# EAGLE design VM-MCU_v4.6 (EAGLE 9.6.2)

## Sheet 1 of 3: MAINBOARD UNIT
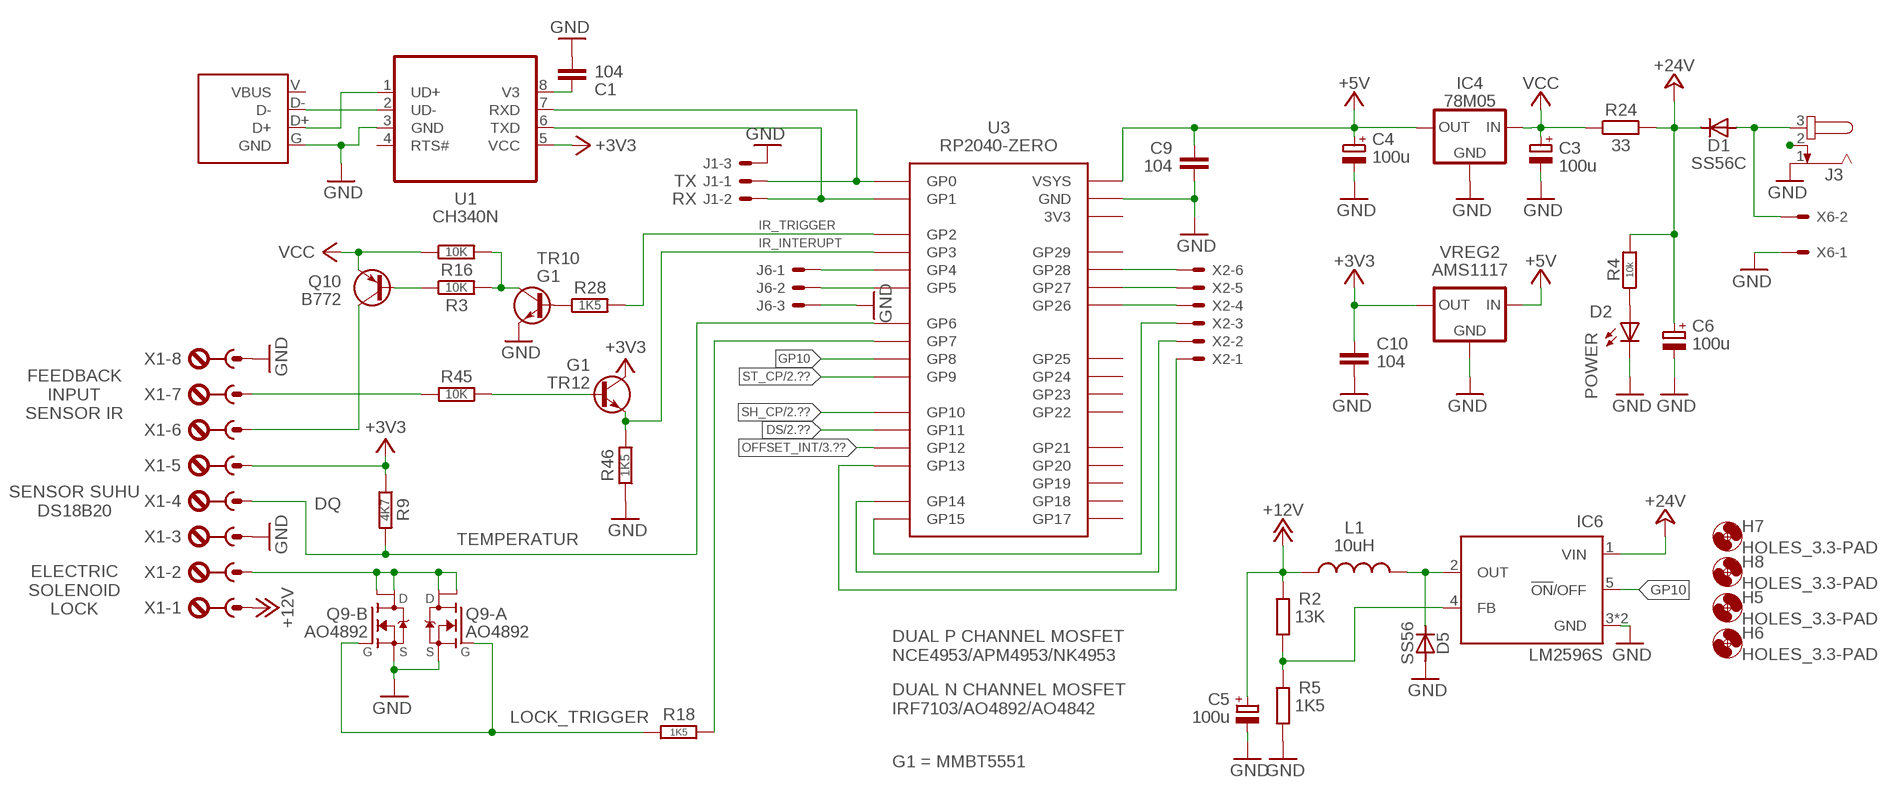
[diagram p0: schematic, sheet 1]

### Parts
C1  104  CAP_SMD-C1206  [C1206]
C3  100u  ELCO_UD-6,3X7,7  [UD-6,3X7,7_NICHICON]
C4  100u  ELCO_UD-6,3X7,7  [UD-6,3X7,7_NICHICON]
C5  100u  ELCO_UD-6,3X7,7  [UD-6,3X7,7_NICHICON]
C6  100u  ELCO_UD-6,3X7,7  [UD-6,3X7,7_NICHICON]
C9  104  CAP_SMD-C1206  [C1206]
C10  104  CAP_SMD-C1206  [C1206]
D1  SS56C  DIODE_DO214AB-SMC  [DO214AB]
D2  POWER  LED2835  [LED2835]
D5  SS56  DIODE_DO214AC  [DO214AC]
H5  HOLES_3.3-PAD  [3,3-PAD]
H6  HOLES_3.3-PAD  [3,3-PAD]
H7  HOLES_3.3-PAD  [3,3-PAD]
H8  HOLES_3.3-PAD  [3,3-PAD]
IC4  78M05  78XXX_TO252  [TO252]
IC6  LM2596S  [TO263-5]
J1  SOKET-3P_JST-XH-2.54  [3P-JST-XH]
J3  JACK-DC_5.5X2.1MM  [DC-5.5X2.1]
J6  SOKET-3P_JST-XH-2.54  [3P-JST-XH]
L1  10uH  INDUKTORSMD  [CDRH127/LD]
Q9  AO4892  DUALFET-N_AO4892N+N  [SO-8]
Q10  B772  BJT-PNP_SOT89  [SOT89-BCE]
R2  13K  RESISTOR_1206  [R1206]
R3  10K  RESISTOR_1206  [R1206]
R4  10k  RESISTOR_1206  [R1206]
R5  1K5  RESISTOR_1206  [R1206]
R9  4K7  RESISTOR_1206  [R1206]
R16  10K  RESISTOR_1206  [R1206]
R18  1K5  RESISTOR_1206  [R1206]
R24  33  RESISTOR_0615/15  [2W-15]
R28  1K5  RESISTOR_1206  [R1206]
R45  10K  RESISTOR_1206  [R1206]
R46  1K5  RESISTOR_1206  [R1206]
TR10  G1  BJT-NPN_SOT23-BEC  [SOT23-BEC]
TR12  G1  BJT-NPN_SOT23-BEC  [SOT23-BEC]
U1  CH340N  [SO-8]
U3  RP2040-ZERO  RASPBERRY-PICO-ZERO_  [PICO-ZERO]
U$3  USB-C_BREAKOUT_  [USB-C_4P]
VREG2  AMS1117  78XXX_SOT223  [SOT223]
X1  TBLOCK-8P_KF2EDG-3.81  [KF2EDG-3.81_8P]
X2  SOKET-6P_JST-XH-2.54  [6P-JST-XH]
X6  SOKET-2P_MOLEX-3.96  [2P-MOLEX]

### Nets
+3V3: C10.1 R9.1 TR12.C U1.5(VCC) VREG2.4(OUT) X1.5 ; also sheet 3
+5V: C4.+ C9.1 IC4.2(OUT) U3.5V(VSYS) VREG2.3(IN) ; also sheet 2
+12V: C5.+ L1.1 R2.1 X1.1
+24V: C6.+ D1.C IC6.1(VIN) R4.2 R24.2 ; also sheet 2
DS: U3.P11(GP11) ; also sheet 2
GND: C1.2 C3.- C4.- C5.- C6.- C9.2 C10.2 D2.C D5.A IC4.3(GND) IC6.3(GND) IC6.6(GND) J1.3 J3.1 J6.3 Q9.1(-A:S) Q9.3(-B:S) R5.2 R46.1 TR10.E U1.3(GND) U3.G(GND) U$3.G(GND) VREG2.1(GND) X1.3 X1.8 X6.1 ; also sheet 2,3
GP10: IC6.5(!ON!/OFF) U3.P8(GP8)
N$1: J1.1 U1.7(RXD) U3.P0(GP0)
N$2: J1.2 U1.6(TXD) U3.P1(GP1)
N$3: D1.A J3.3 X6.2
N$4: D2.A R4.1
N$5: J6.1 U3.P4(GP4)
N$6: R3.2 R16.2 TR10.C
N$7: Q10.B R3.1
N$8: J6.2 U3.P5(GP5)
N$9: U3.P28(GP28) X2.6
N$10: U3.P27(GP27) X2.5
N$11: U3.P26(GP26) X2.4
N$13: U3.P15(GP15) X2.3
N$23: Q10.E X1.6
N$33: Q9.2(-A:G) Q9.4(-B:G) R18.2
N$34: C1.1 U1.8(V3)
N$36: U1.2(UD-) U$3.D-
N$43: J3.2
N$45: U1.1(UD+) U$3.D+
N$46: U3.P14(GP14) X2.2
N$47: U3.P13(GP13) X2.1
N$60: Q9.5(-B:D1) Q9.6(-B:D2) Q9.7(-A:D2) Q9.8(-A:D1) X1.2
N$68: D5.C IC6.2(OUT) L1.2
N$71: IC6.4(FB) R2.2 R5.1
N$73: R28.1 TR10.B
N$74: R45.1 TR12.B
N$86: R45.2 X1.7
OFFSET_INT: U3.P12(GP12) ; also sheet 3
P2: R28.2 U3.P2(GP2)
P3: R46.2 TR12.E U3.P3(GP3)
P6: R9.2 U3.P6(GP6) X1.4
P7: R18.1 U3.P7(GP7)
SH_CP: U3.P10(GP10) ; also sheet 2
ST_CP: U3.P9(GP9) ; also sheet 2
VCC: C3.+ IC4.1(IN) Q10.C R16.1 R24.1
Unconnected: U1.4(RTS#) U3.P17(GP17) U3.P18(GP18) U3.P19(GP19) U3.P20(GP20) U3.P21(GP21) U3.P22(GP22) U3.P23(GP23) U3.P24(GP24) U3.P25(GP25) U3.P29(GP29) U$3.V(VBUS)

### Notes on the sheet
- TX
- RX
- IR_TRIGGER
- IR_INTERUPT
- FEEDBACK
  INPUT
  SENSOR IR
- SENSOR SUHU
  DS18B20
- DQ
- TEMPERATUR
- ELECTRIC
  SOLENOID
  LOCK
- DUAL P CHANNEL MOSFET
  NCE4953/APM4953/NK4953
- DUAL N CHANNEL MOSFET
  IRF7103/AO4892/AO4842
- LOCK_TRIGGER
- G1 = MMBT5551

## Sheet 2 of 3: SHIFT REGISTER & MOSFET DRIVER
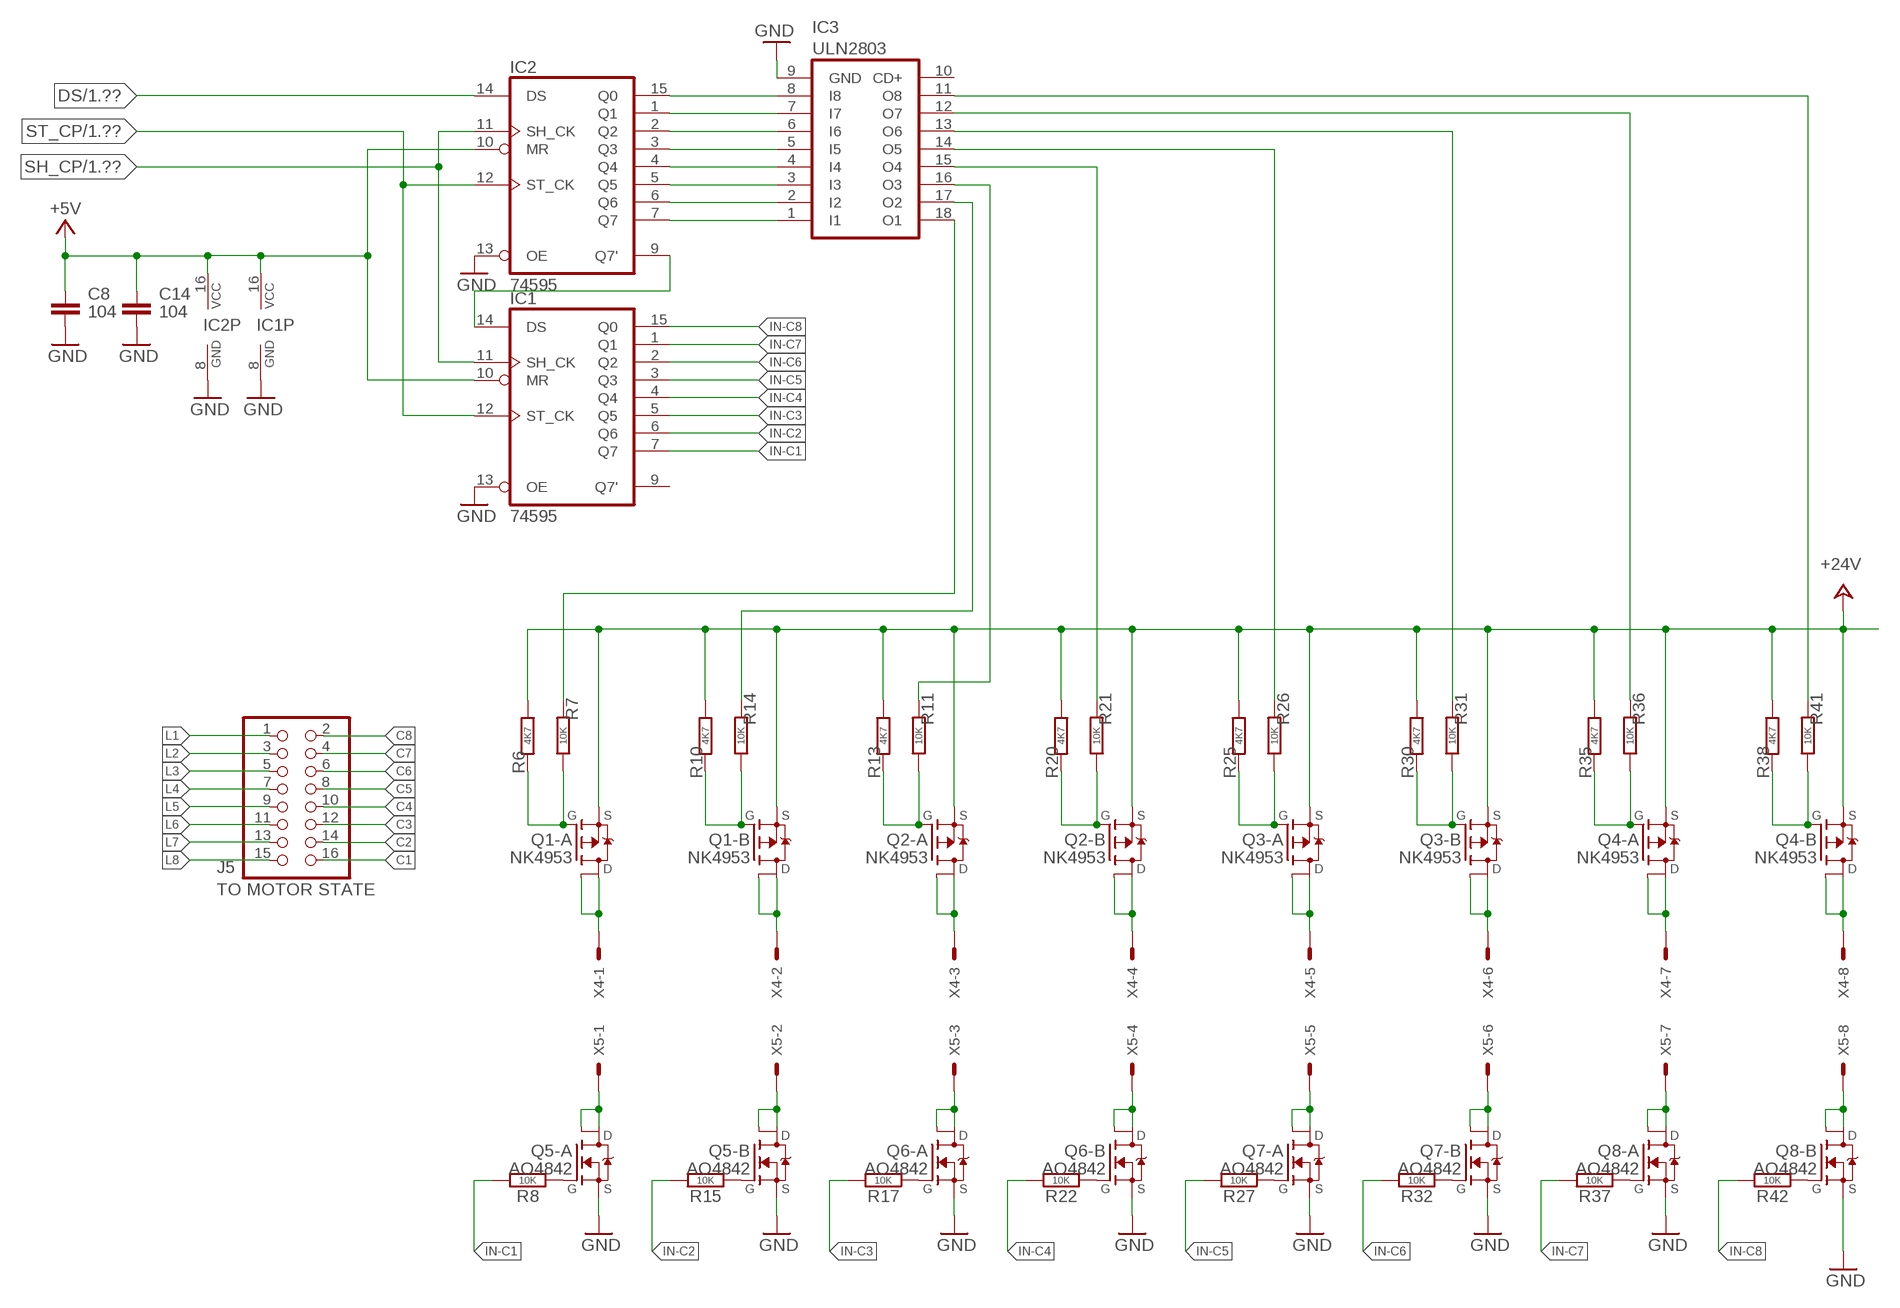
[diagram p1: schematic, sheet 2]

### Parts
C8  104  CAP_SMD-C1206  [C1206]
C14  104  CAP_SMD-C1206  [C1206]
IC1  74595  [SO16]
IC2  74595  [SO16]
IC3  ULN2803  ULN2805ASO18  [SO18W]
J5  TO MOTOR STATE  PINHEAD_2X8SMT  [PINHEAD-SMT_2X08]
Q1  NK4953  DUALFET-P_NCE4953P+P  [SO-8]
Q2  NK4953  DUALFET-P_NCE4953P+P  [SO-8]
Q3  NK4953  DUALFET-P_NCE4953P+P  [SO-8]
Q4  NK4953  DUALFET-P_NCE4953P+P  [SO-8]
Q5  AO4842  DUALFET-N_AO4892N+N  [SO-8]
Q6  AO4842  DUALFET-N_AO4892N+N  [SO-8]
Q7  AO4842  DUALFET-N_AO4892N+N  [SO-8]
Q8  AO4842  DUALFET-N_AO4892N+N  [SO-8]
R6  4K7  RESISTOR_1206  [R1206]
R7  10K  RESISTOR_1206  [R1206]
R8  10K  RESISTOR_1206  [R1206]
R10  4K7  RESISTOR_1206  [R1206]
R11  10K  RESISTOR_1206  [R1206]
R13  4K7  RESISTOR_1206  [R1206]
R14  10K  RESISTOR_1206  [R1206]
R15  10K  RESISTOR_1206  [R1206]
R17  10K  RESISTOR_1206  [R1206]
R20  4K7  RESISTOR_1206  [R1206]
R21  10K  RESISTOR_1206  [R1206]
R22  10K  RESISTOR_1206  [R1206]
R25  4K7  RESISTOR_1206  [R1206]
R26  10K  RESISTOR_1206  [R1206]
R27  10K  RESISTOR_1206  [R1206]
R30  4K7  RESISTOR_1206  [R1206]
R31  10K  RESISTOR_1206  [R1206]
R32  10K  RESISTOR_1206  [R1206]
R35  4K7  RESISTOR_1206  [R1206]
R36  10K  RESISTOR_1206  [R1206]
R37  10K  RESISTOR_1206  [R1206]
R38  4K7  RESISTOR_1206  [R1206]
R41  10K  RESISTOR_1206  [R1206]
R42  10K  RESISTOR_1206  [R1206]
X4  SOKET-8P_MOLEX-3.96  [8P-MOLEX]
X5  SOKET-8P_MOLEX-3.96  [8P-MOLEX]

### Nets
+5V: C8.1 C14.1 IC1.10(MR) IC1.16(VCC) IC2.10(MR) IC2.16(VCC) ; also sheet 1
+24V: Q1.1(-A:S) Q1.3(-B:S) Q2.1(-A:S) Q2.3(-B:S) Q3.1(-A:S) Q3.3(-B:S) Q4.1(-A:S) Q4.3(-B:S) R6.1 R10.1 R13.1 R20.1 R25.1 R30.1 R35.1 R38.1 ; also sheet 1
C1: J5.16 Q5.7(-A:D2) Q5.8(-A:D1) X5.1
C2: J5.14 Q5.5(-B:D1) Q5.6(-B:D2) X5.2
C3: J5.12 Q6.7(-A:D2) Q6.8(-A:D1) X5.3
C4: J5.10 Q6.5(-B:D1) Q6.6(-B:D2) X5.4
C5: J5.8 Q7.7(-A:D2) Q7.8(-A:D1) X5.5
C6: J5.6 Q7.5(-B:D1) Q7.6(-B:D2) X5.6
C7: J5.4 Q8.7(-A:D2) Q8.8(-A:D1) X5.7
C8: J5.2 Q8.5(-B:D1) Q8.6(-B:D2) X5.8
DS: IC2.14(DS) ; also sheet 1
GND: C8.2 C14.2 IC1.8(GND) IC1.13(OE) IC2.8(GND) IC2.13(OE) IC3.9(GND) Q5.1(-A:S) Q5.3(-B:S) Q6.1(-A:S) Q6.3(-B:S) Q7.1(-A:S) Q7.3(-B:S) Q8.1(-A:S) Q8.3(-B:S) ; also sheet 1,3
IN-C1: IC1.7(Q7) R8.2
IN-C2: IC1.6(Q6) R15.2
IN-C3: IC1.5(Q5) R17.2
IN-C4: IC1.4(Q4) R22.2
IN-C5: IC1.3(Q3) R27.2
IN-C6: IC1.2(Q2) R32.2
IN-C7: IC1.1(Q1) R37.2
IN-C8: IC1.15(Q0) R42.2
L1: J5.1 Q1.7(-A:D2) Q1.8(-A:D1) X4.1
L2: J5.3 Q1.5(-B:D1) Q1.6(-B:D2) X4.2
L3: J5.5 Q2.7(-A:D2) Q2.8(-A:D1) X4.3
L4: J5.7 Q2.5(-B:D1) Q2.6(-B:D2) X4.4
L5: J5.9 Q3.7(-A:D2) Q3.8(-A:D1) X4.5
L6: J5.11 Q3.5(-B:D1) Q3.6(-B:D2) X4.6
L7: J5.13 Q4.7(-A:D2) Q4.8(-A:D1) X4.7
L8: J5.15 Q4.5(-B:D1) Q4.6(-B:D2) X4.8
N$12: IC2.15(Q0) IC3.8(I8)
N$15: IC2.1(Q1) IC3.7(I7)
N$16: Q1.2(-A:G) R6.2 R7.1
N$18: IC3.17(O2) R14.2
N$19: Q5.2(-A:G) R8.1
N$20: Q1.4(-B:G) R10.2 R14.1
N$21: IC2.2(Q2) IC3.6(I6)
N$22: Q2.2(-A:G) R11.1 R13.2
N$26: IC2.3(Q3) IC3.5(I5)
N$27: Q5.4(-B:G) R15.1
N$29: IC2.4(Q4) IC3.4(I4)
N$31: IC3.18(O1) R7.2
N$32: Q2.4(-B:G) R20.2 R21.1
N$35: Q6.2(-A:G) R17.1
N$37: IC2.5(Q5) IC3.3(I3)
N$38: IC2.6(Q6) IC3.2(I2)
N$39: IC2.7(Q7) IC3.1(I1)
N$40: IC3.16(O3) R11.2
N$41: IC3.15(O4) R21.2
N$42: Q3.2(-A:G) R25.2 R26.1
N$44: Q6.4(-B:G) R22.1
N$48: IC3.14(O5) R26.2
N$49: Q3.4(-B:G) R30.2 R31.1
N$51: Q7.2(-A:G) R27.1
N$55: IC3.13(O6) R31.2
N$56: Q4.2(-A:G) R35.2 R36.1
N$58: Q7.4(-B:G) R32.1
N$62: IC3.12(O7) R36.2
N$63: Q4.4(-B:G) R38.2 R41.1
N$65: Q8.2(-A:G) R37.1
N$69: IC3.11(O8) R41.2
N$70: Q8.4(-B:G) R42.1
N$84: IC1.14(DS) IC2.9(Q7')
SH_CP: IC1.11(SH_CK) IC2.11(SH_CK) ; also sheet 1
ST_CP: IC1.12(ST_CK) IC2.12(ST_CK) ; also sheet 1
Unconnected: IC1.9(Q7') IC3.10(CD+)

## Sheet 3 of 3: ROTATION COUNTER
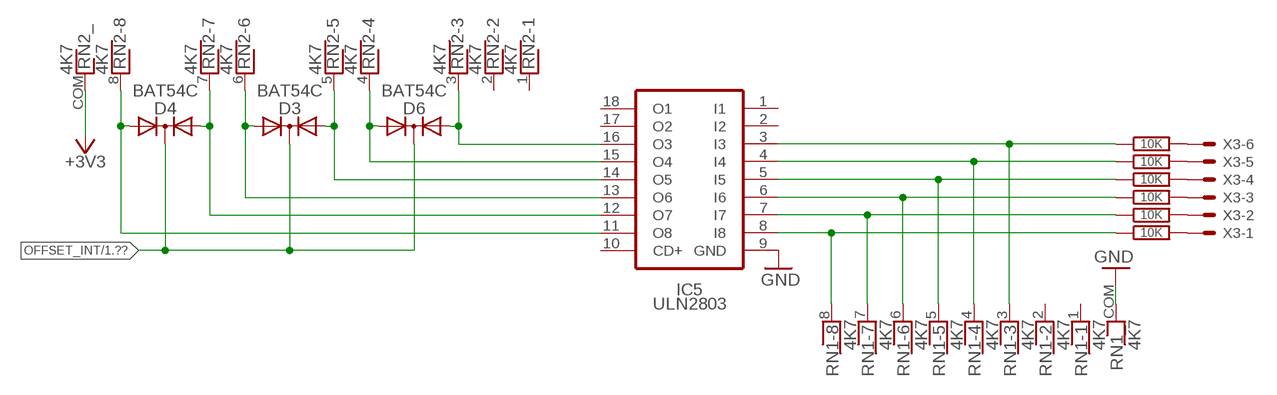
[diagram p2: schematic, sheet 3]

### Parts
D3  BAT54C  DIODE-3PIN_COMMON-CATHODE  [SOT23-BCE]
D4  BAT54C  DIODE-3PIN_COMMON-CATHODE  [SOT23-BCE]
D6  BAT54C  DIODE-3PIN_COMMON-CATHODE  [SOT23-BCE]
IC5  ULN2803  ULN2805ASO18  [SO18W]
R39  10K  RESISTOR_1206  [R1206]
R43  10K  RESISTOR_1206  [R1206]
R44  10K  RESISTOR_1206  [R1206]
R47  10K  RESISTOR_1206  [R1206]
R48  10K  RESISTOR_1206  [R1206]
R49  10K  RESISTOR_1206  [R1206]
RN1  4K7  RESISTOR-PACK-X8_  [RN-9]
RN2  4K7  RESISTOR-PACK-X8_  [RN-9]
X3  SOKET-6P_MOLEX-3.96  [6P-MOLEX]

### Nets
+3V3: RN2.COM ; also sheet 1
GND: IC5.9(GND) RN1.COM ; also sheet 1,2
I1: IC5.3(I3) R39.1 RN1.3
I2: IC5.4(I4) R43.1 RN1.4
I3: IC5.5(I5) R44.1 RN1.5
I4: IC5.6(I6) R47.1 RN1.6
I5: IC5.7(I7) R48.1 RN1.7
I6: IC5.8(I8) R49.1 RN1.8
N$14: R49.2 X3.1
N$17: R48.2 X3.2
N$24: R47.2 X3.3
N$25: R44.2 X3.4
N$28: R43.2 X3.5
N$30: R39.2 X3.6
O1: D6.B(A1) IC5.16(O3) RN2.3
O2: D6.E(A2) IC5.15(O4) RN2.4
O3: D3.B(A1) IC5.14(O5) RN2.5
O4: D3.E(A2) IC5.13(O6) RN2.6
O5: D4.B(A1) IC5.12(O7) RN2.7
O6: D4.E(A2) IC5.11(O8) RN2.8
OFFSET_INT: D3.C D4.C D6.C ; also sheet 1
Unconnected: IC5.1(I1) IC5.2(I2) IC5.10(CD+) IC5.17(O2) IC5.18(O1) RN1.1 RN1.2 RN2.1 RN2.2

## Power pins joined to a net without a drawn wire
3V3: U3.3V3

## Library data of the parts
C1 C8-C10 C14 = MyFavorite:CAP_: CAPACITOR, European symbol
C3-C6 = MyFavorite:ELCO_: POLARIZED CAPACITOR, European symbol; SPICEPREFIX: C
D1 D5 = MyFavorite:DIODE_
D2 = MyFavorite:LED
D3 D4 D6 = MyFavorite:DIODE-3PIN_
H5-H8 = MyFavorite:HOLES_: MOUNTING HOLE with drill center marker
IC1 IC2 = VM-MCU:74*595: 8-bit SHIFT REGISTER, output latch
IC3 IC5 = VM-MCU:ULN2805A: DRIVER ARRAY
IC4 VREG2 = VM-MCU:78XXX_: VOLTAGE REGULATOR
IC6 = VM-MCU:LM2596: SIMPLE SWITCHER® Power Converter 150 kHz 3A Step-Down Voltage Regulator Source: http://www.national.com/ds/LM/LM2596.pdf; MF: NATIONAL SEMICONDUCTOR; MPN: LM2596S-ADJ/NOPB; OC_FARNELL: 9494367; OC_NEWARK: 41K3842
J1 J6 = MYConnector:SOKET-3P_: KK 156 HEADER Source: http://www.molex.com/pdm_docs/sd/026604100_sd.pdf
J3 = MyFavorite:JACK-DC_: DC POWER JACK Power Jack, DC, Right Angle, Through Hole, Rated 5A at 16VDC, PC Terminals Distributor: Farnell (www.Farnell.de) Drawing: 84N1161.pdf / 84N1162.pdf Manufacturer: SPC Technology (www.spctechnology.com) Type: SPC4077 / SPC 4078; OC_FARNELL: unknown; OC_NEWARK: unknown
J5 = MYConnector:PINHEAD_2X8
L1 = MyFavorite:INDUKTOR
Q1-Q4 = VM-MCU:DUALFET-P_
Q5-Q9 = VM-MCU:DUALFET-N_
Q10 = VM-MCU:BJT-PNP_: PNP Transistror
R2 R3 R5 R9 R16 R18 R28 R39 R43 R44 R46-R49 = VM-MCU:RESISTOR_: RESISTOR, European symbol
R4 R6-R8 R10 R11 R13-R15 R17 R20-R22 R24-R27 R30-R32 R35-R38 R41 R42 R45 = MyFavorite:RESISTOR_: RESISTOR, European symbol
RN1 RN2 = MyFavorite:RESISTOR-PACK-X8_: RESISTOR NETWORK
TR10 TR12 = VM-MCU:BJT-NPN_: NPN Transistror BF959 corrected 2008.03.06
U1 = VM-MCU:CH340N
U3 = VM-MCU:RASPBERRY-PICO-ZERO_
U$3 = VM-MCU:USB-C_BREAKOUT_
X1 = MYConnector:TBLOCK-8P_: PHOENIX
X2 = MYConnector:SOKET-6P_: KK 156 HEADER Source: http://www.molex.com/pdm_docs/sd/026604100_sd.pdf
X3 = MYConnector:SOKET-6P_: KK 156 HEADER Source: http://www.molex.com/pdm_docs/sd/026604100_sd.pdf; MF: MOLEX; OC_FARNELL: unknown; OC_NEWARK: unknown
X4 X5 = MYConnector:SOKET-8P_: KK 156 HEADER Source: http://www.molex.com/pdm_docs/sd/026604100_sd.pdf; MF: MOLEX; OC_FARNELL: unknown; OC_NEWARK: unknown
X6 = MYConnector:SOKET-2P_: KK 156 HEADER Source: http://www.molex.com/pdm_docs/sd/026604100_sd.pdf; MF: MOLEX; OC_FARNELL: unknown; OC_NEWARK: unknown

## Board
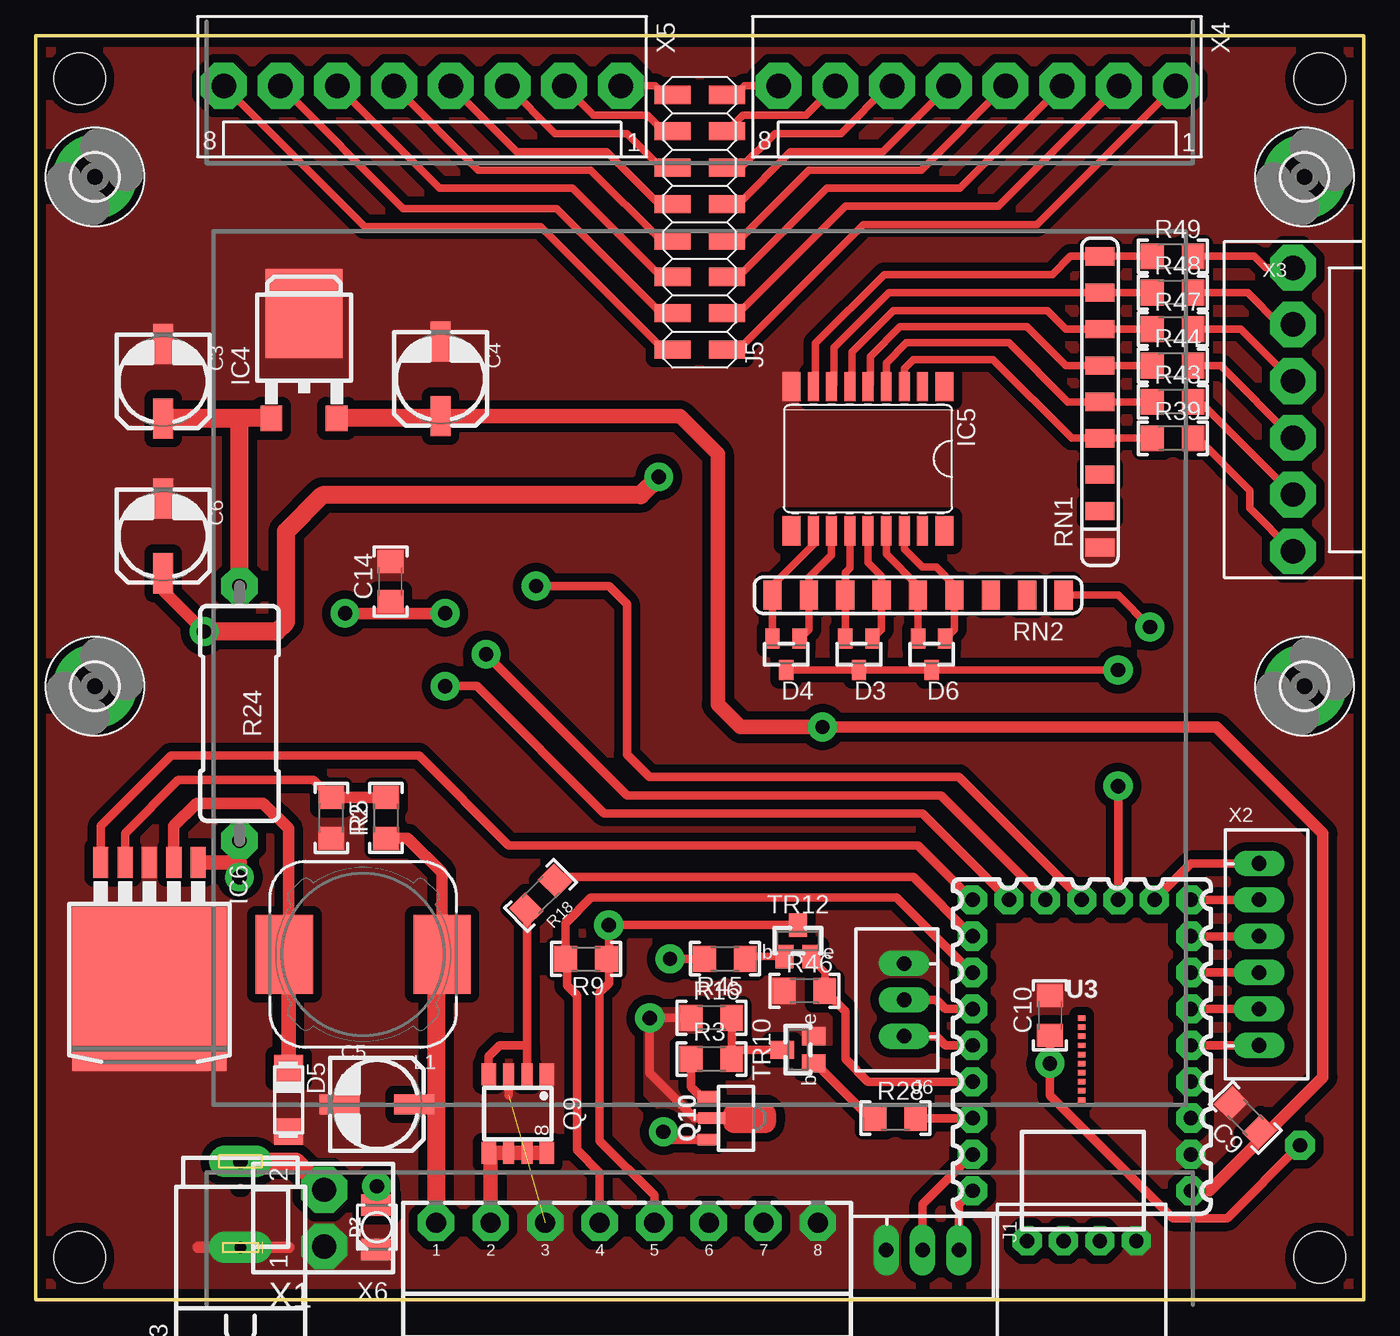
[diagram p3: board, top side]
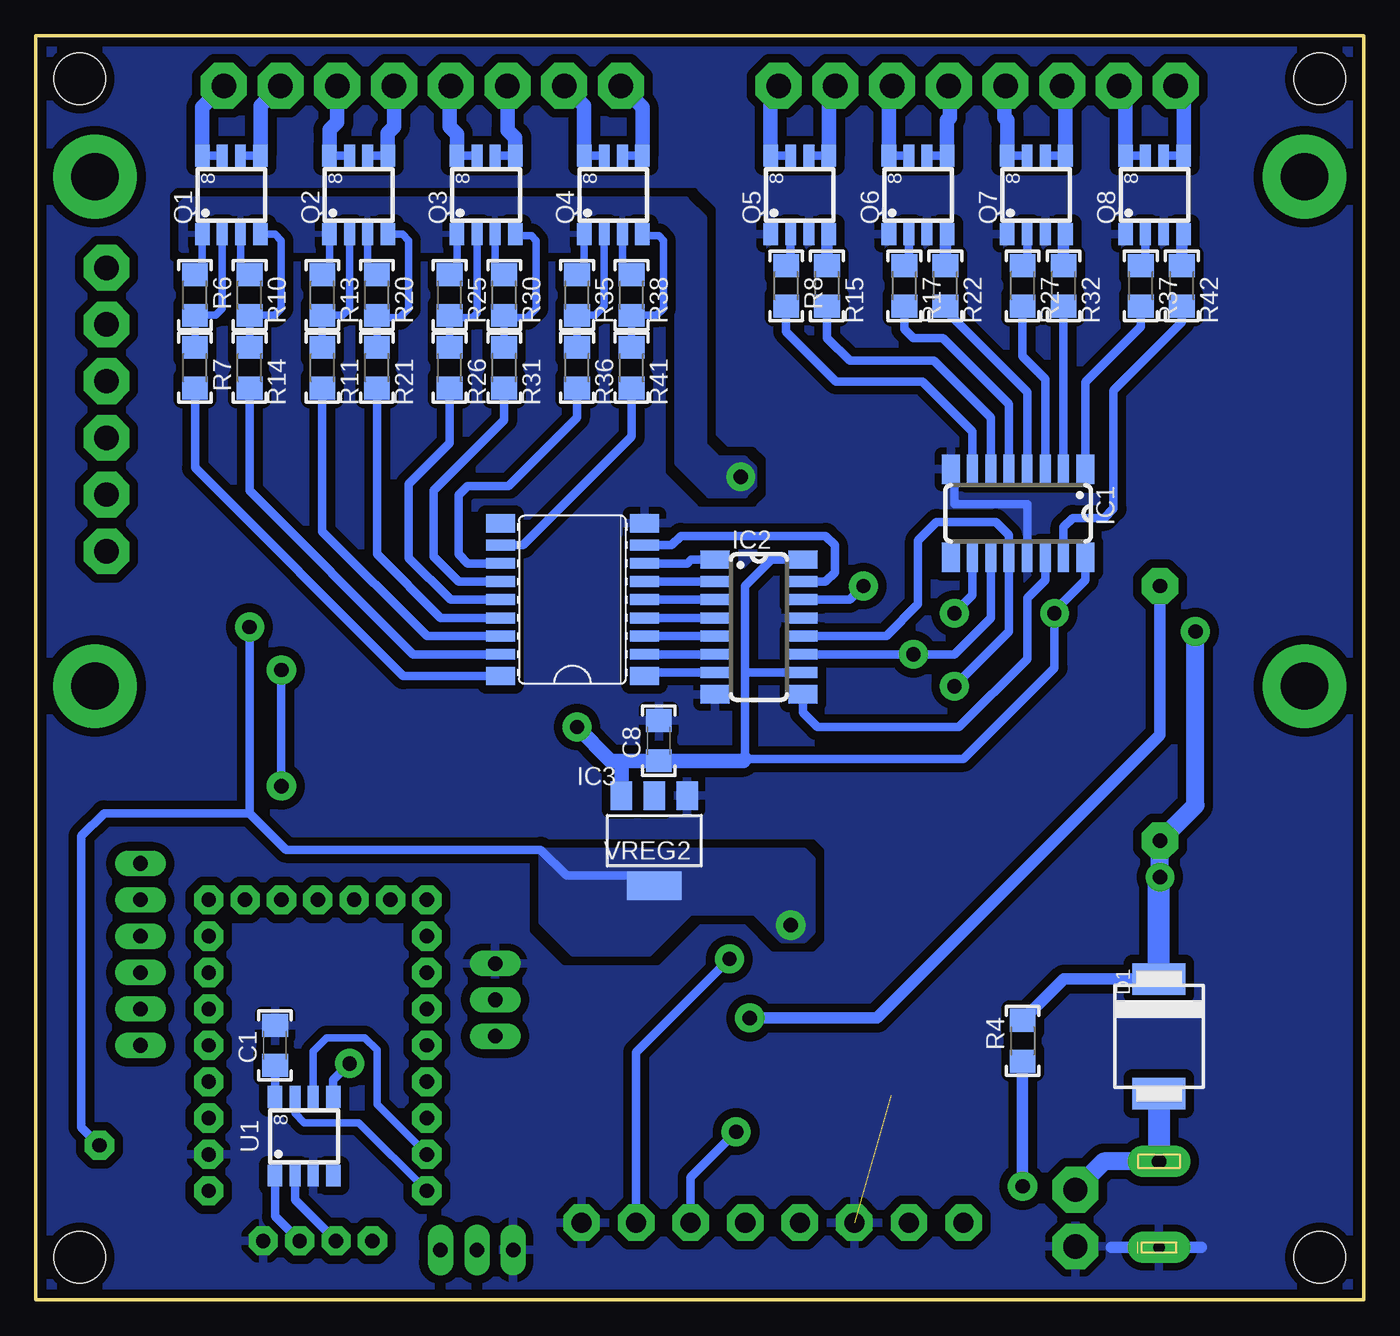
[diagram p4: board, bottom side, seen from below]

Size 92.71 x 88.27 mm. Coordinates in mm from the lower left corner, seen from the top.
Copper layers (1*16): Top 0.035mm / dielectric 1.5mm / Bottom 0.035mm
Design rules "default *": minimum track width 6mil, minimum drill 0.35mm, track to track 24mil, track to pad 6mil, pad to pad 0mil, via to via 6mil, smd to smd 0mil, copper to edge 24mil, drill to drill 6mil, minimum pad ring 10mil, minimum via ring 8mil, stop-mask expansion 4mil, vias tented up to drill 0mil, thermal gap 20mil

### Footprints (pad centres in the part's own frame; a part is rotated, then mirrored left to right if it is on the bottom)
C1206 = smd 1.6 x 1.8: 1 -1.4,0; 2 1.4,0
UD-6,3X7,7_NICHICON = smd 2.8 x 1.397: + 2.604,0; - -2.604,0
DO214AB = smd 2.2 x 3.7: A 4,0; C -4,0
LED2835 = smd 1.5 x 2.2: A -1.55,0; C 1.55,0
SOT23-BCE = smd 1 x 1.4: B -0.95,-1.1; C 0,1.1; E 0.95,-1.1
DO214AC = smd 1.88 x 2.032: A 2.21,0; C -2.21,0
3,3-PAD = drill 3.3 pad 5.842: 3.3 0,0
SO16 = smd 1.27 x 2.032: 1 -4.699,-3.073; 8 4.699,-3.073; 9 4.699,3.073; 16 -4.699,3.073 | smd 0.762 x 2.032: 2 -3.175,-3.073; 3 -1.905,-3.073; 4 -0.635,-3.073; 5 0.635,-3.073; 6 1.905,-3.073; 7 3.175,-3.073; 10 3.175,3.073; 11 1.905,3.073; 12 0.635,3.073; 13 -0.635,3.073; 14 -1.905,3.073; 15 -3.175,3.073
SO18W = smd 1.27 x 2.032: 1 -5.334,-5.029; 9 5.334,-5.029; 10 5.334,5.029; 18 -5.334,5.029 | smd 0.762 x 2.032: 2 -3.81,-5.029; 3 -2.54,-5.029; 4 -1.27,-5.029; 5 0,-5.029; 6 1.27,-5.029; 7 2.54,-5.029; 8 3.81,-5.029; 11 3.81,5.029; 12 2.54,5.029; 13 1.27,5.029; 14 0,5.029; 15 -1.27,5.029; 16 -2.54,5.029; 17 -3.81,5.029
TO252 = smd 1.524 x 1.778: 1 -2.28,-4.8; 2 2.28,-4.8 | smd 5.4 x 6.2: 3 0,2.5
TO263-5 = smd 1.067 x 2.159: 1 -3.404,-5.791; 2 -1.702,-5.791; 3 0,-5.791; 4 1.702,-5.791; 5 3.404,-5.791 | smd 10.8 x 11.43: 6 0,3.048
3P-JST-XH = drill 1.016 pad 1.778 long: 1 -2.54,0; 2 0,0; 3 2.54,0
DC-5.5X2.1 = drill 0.8 pad 2.184 long: 1 -3,0 | smd 0.254 x 0.254: 2 1.27,0 | drill 1 pad 2.184 long: 3 3,0
PINHEAD-SMT_2X08 = smd 1.27 x 2.54: 1 0,-0.635; 2 0,3.175; 3 2.54,-0.635; 4 2.54,3.175; 5 5.08,-0.635; 6 5.08,3.175; 7 7.62,-0.635; 8 7.62,3.175; 9 10.16,-0.635; 10 10.16,3.175; 11 12.7,-0.635; 12 12.7,3.175; 13 15.24,-0.635; 14 15.24,3.175; 15 17.78,-0.635; 16 17.78,3.175
CDRH127/LD = smd 4 x 5.5: 1 -5.5,0; 2 5.5,0
SO-8 = smd 1.524 x 1.016: 1 -2.743,2.032; 4 -2.743,-2.032; 5 2.743,-2.032; 8 2.743,2.032 | smd 1.524 x 0.762: 2 -2.743,0.635; 3 -2.743,-0.635; 6 2.743,-0.635; 7 2.743,0.635
SOT89-BCE = smd 0.8 x 1.4: B -1.499,-1.981; E 1.499,-1.981 | smd 0.8 x 1.9: C 0,-1.727
R1206 = smd 1.6 x 1.803: 1 -1.422,0; 2 1.422,0
2W-15 = drill 1 pad 2.54 octagon: 1 -8.89,0; 2 8.89,0
RN-9 = smd 1.27 x 2.032: 1 2.54,0; 2 5.08,0; 3 7.62,0; 4 10.16,0; 5 12.7,0; 6 15.24,0; 7 17.78,0; 8 20.32,0; COM 0,0
SOT23-BEC = smd 1.27 x 1.651: B -0.95,-1.1; C 0,1.1; E 0.95,-1.1
PICO-ZERO = drill 1 pad 2.032 octagon: 3V3 0,-5.08; 5V 0,0; G 0,-2.54; P0 15.24,0; P1 15.24,-2.54; P2 15.24,-5.08; P3 15.24,-7.62; P4 15.24,-10.16; P5 15.24,-12.7; P6 15.24,-15.24; P7 15.24,-17.78; P8 15.24,-20.32; P9 12.7,-20.32; P10 10.16,-20.32; P11 7.62,-20.32; P12 5.08,-20.32; P13 2.54,-20.32; P14 0,-20.32; P15 0,-17.78; P26 0,-15.24; P27 0,-12.7; P28 0,-10.16; P29 0,-7.62 | smd 0.508 x 0.381: GND2 7.62,-6.35; P17 7.62,-12.065; P18 7.62,-11.43; P19 7.62,-10.795; P20 7.62,-10.16; P21 7.62,-9.525; P22 7.62,-8.89; P23 7.62,-8.255; P24 7.62,-7.62; P25 7.62,-6.985
BOX-PLC_115X90_V2 = hole 3.6: -43.276,41.15; 43.276,41.15; -43.276,-41.15; 43.276,-41.15
USB-C_4P = drill 1 pad 2.032 octagon: D+ 0,-5.08; D- 0,-2.54; G 0,-7.62; V 0,0
SOT223 = smd 1.5 x 2: 1 -2.3,-3.15; 2 0,-3.15; 3 2.3,-3.15 | smd 3.8 x 2: 4 0,3.15
KF2EDG-3.81_8P = drill 1.4 pad 2.54 octagon: 1 0,0; 2 3.81,0; 3 7.62,0; 4 11.43,0; 5 15.24,0; 6 19.05,0; 7 22.86,0; 8 26.67,0
6P-JST-XH = drill 1.016 pad 1.778 long: 1 -6.35,0; 2 -3.81,0; 3 -1.27,0; 4 1.27,0; 5 3.81,0; 6 6.35,0
6P-MOLEX = drill 1.7 pad 3.2 octagon: 1 -9.9,0; 2 -5.94,0; 3 -1.98,0; 4 1.98,0; 5 5.94,0; 6 9.9,0
8P-MOLEX = drill 1.7 pad 3.2 octagon: 1 -13.86,0; 2 -9.9,0; 3 -5.94,0; 4 -1.98,0; 5 1.98,0; 6 5.94,0; 7 9.9,0; 8 13.86,0
2P-MOLEX = drill 1.7 pad 3.2 octagon: 1 -1.98,0; 2 1.98,0

### Placement (x,y rotation side)
C1  76.01,17.78 90 bottom
C3  8.89,64.14 270 top
C4  28.26,64.31 270 top
C5  23.81,13.65 0 top
C6  8.89,53.34 270 top
C8  49.21,39.05 90 bottom
C9  84.45,12.75 135 top
C10  70.8,19.88 90 top
C14  24.76,50.16 90 top
D1  14.29,18.41 270 bottom
D2  23.81,5.08 270 top
D3  57.47,45.09 180 top
D4  52.39,45.09 180 top
D5  17.64,13.97 270 top
D6  62.55,45.09 180 top
H5  88.58,42.86 0 top
H6  4.13,42.86 0 top
H7  88.58,78.42 0 top
H8  4.13,78.42 0 top
IC1  24.13,54.93 180 bottom
IC2  42.23,46.99 270 bottom
IC3  55.24,48.9 90 bottom
IC4  18.73,66.36 0 top
IC5  58.1,58.74 180 top
IC6  7.94,24.77 180 top
J1  61.91,3.49 180 top
J3  14.29,6.67 90 top
J5  47.62,66.36 90 top
J6  60.64,20.96 90 top
L1  22.86,24.13 180 top
Q1  79.06,77.15 90 bottom
Q2  70.17,77.15 90 bottom
Q3  61.28,77.15 90 bottom
Q4  52.39,77.15 90 bottom
Q5  39.37,77.15 90 bottom
Q6  31.11,77.15 90 bottom
Q7  22.86,77.15 90 bottom
Q8  14.6,77.15 90 bottom
Q9  33.66,13.02 270 top
Q10  48.89,12.7 270 top
R2  24.45,33.66 90 top
R3  47.17,16.83 0 top
R4  23.81,18.1 90 bottom
R5  20.64,33.66 270 top
R6  81.6,70.17 270 bottom
R7  81.6,65.09 270 bottom
R8  40.32,70.8 270 bottom
R9  38.42,23.81 180 top
R10  77.79,70.17 270 bottom
R11  72.71,65.09 270 bottom
R13  72.71,70.17 270 bottom
R14  77.79,65.09 270 bottom
R15  37.46,70.8 270 bottom
R16  47.17,19.7 0 top
R17  32.07,70.8 270 bottom
R18  35.24,28.26 225 top
R20  68.9,70.17 270 bottom
R21  68.9,65.09 270 bottom
R22  29.21,70.8 270 bottom
R24  14.22,40.96 270 top
R25  63.82,70.17 270 bottom
R26  63.82,65.09 270 bottom
R27  23.81,70.8 270 bottom
R28  60.01,12.7 0 top
R30  60.01,70.17 270 bottom
R31  60.01,65.09 270 bottom
R32  20.95,70.8 270 bottom
R35  54.93,70.17 270 bottom
R36  54.93,65.09 270 bottom
R37  15.56,70.8 270 bottom
R38  51.12,70.17 270 bottom
R39  79.38,60.17 0 top
R41  51.12,65.09 270 bottom
R42  12.7,70.8 270 bottom
R43  79.38,62.71 0 top
R44  79.38,65.25 0 top
R45  48.11,23.83 180 top
R46  53.66,21.59 0 top
R47  79.38,67.79 0 top
R48  79.38,70.33 0 top
R49  79.38,72.87 0 top
RN1  74.3,52.55 90 top
RN2  71.75,49.21 180 top
TR10  53.21,17.48 90 top
TR12  53.21,25.08 0 top
U1  73.98,11.43 90 bottom
U3  80.64,7.62 180 top
U$1  [BOX-PLC_115X90]  46.35,44.13 0 top
U$2  [BOX-PLC_115X90_V2]  46.35,44.13 0 top
U$3  69.22,4.13 90 top
VREG2  49.53,32.07 180 bottom
X1  27.94,5.4 0 top
X2  85.41,24.13 270 top
X3  87.77,62.17 270 top
X4  65.72,84.77 180 top
X5  26.99,84.77 180 top
X6  20.13,5.72 90 top

### Tracks (layer width: path | path; a pad name or v marks a point on that pad's centre or on a via)
+3V3  (via drill 1 pad 2.03)
  Top 0.508: v77.79,46.99 75.56,49.21 RN2.COM
  Top 0.61: X1.5 43.18,7.3 39.37,11.11 39.37,21.48 40,22.12 40,23.39 | TR12.C v40.01,26.18 v40,26.17 40,23.39 | R9.1 40,23.39 | v88.26,10.8 83.19,5.72 79.38,5.72 70.8,14.29 v70.8,16.51 C10.1
  Bottom 0.61: 77.79,33.97 75.25,31.43 57.47,31.43 55.67,29.63 49.95,29.63 | v77.79,46.99 77.79,33.97 | 77.79,33.97 87.95,33.97 89.53,32.38 89.53,12.06 v88.26,10.8 | U1.5 71.94,15.37 v70.8,16.51
  Bottom 1.016: VREG2.4 49.21,28.6
  pour Bottom (isolate 0.61, no thermals): 57.47,31.43 57.47,26.35 55.24,24.13 49.85,24.13 46.99,26.99 42.54,26.99 40.64,25.08 39.05,25.08 38.42,25.72 38.42,30.8 39.05,31.43
+5V  (via drill 1 pad 2)
  Top 0.61: C14.1 24.76,47.94
  Top 0.813: v21.59,47.94 24.76,47.94 v28.57,47.94 | v54.93,40 82.42,40 89.86,32.57 89.86,15.56 85.72,11.43 | U3.5V 81.91,7.62 85.72,11.43 | C9.1 85.72,11.48 85.72,11.43
  Top 1.016: IC4.2 21.05,61.59 | 28.26,61.56 C4.+ 44.97,61.71 47.62,59.05 47.62,41.59 49.21,40 v54.93,40
  Top 1.27: 28.26,61.56 IC4.2
  Bottom 0.61: IC1.10 27.3,49.21 v28.57,47.94 | 43.18,43.81 43.18,49.85 41.34,51.69 IC2.16 | IC2.10 43.18,43.81 | 43.18,43.81 43.18,37.78 27.94,37.78 21.59,44.13 v21.59,47.94 21.59,48.11 19.43,50.27 IC1.16
  Bottom 1.016: v54.93,40 52.57,37.65 51.83,37.65 | 51.83,37.65 C8.1 43.31,37.65 43.18,37.78 | VREG2.3 51.83,37.65
+12V
  Top 0.813: R2.1 25.97,32.23 28.36,29.85 L1.1 28.57,24.34
  Top 1.016: C5.+ 26.54,13.53 27.94,13.53
  Top 1.27: 28.57,24.34 27.94,23.71 27.94,13.53 X1.1
+24V  (via drill 1 pad 2, 1 pad 2.03)
  Top 0.813: v11.75,46.67 8.89,49.53 C6.+
  Top 1.016: v14.22,29.53 14.22,30.56 IC6.1
  Top 1.27: v11.75,46.67 16.83,46.67 17.46,47.31 17.46,53.66 20,56.2 42.23,56.2 v43.5,57.47
  Bottom 0.508: Q3.1 63.31,72.1 R25.1 | Q3.3 60.64,72.22 R30.1 | Q1.3 78.42,71.75 78.26,71.59 R10.1 | Q1.1 81.09,72.1 R6.1 | Q2.3 69.53,72.07 69.22,71.75 | 68.9,72.07 R20.1 | Q2.1 72.2,72.1 R13.1 | Q4.3 51.75,72.22 R38.1 | Q4.1 54.42,72.1 R35.1
  Bottom 0.61: R20.1 69.06,71.75 69.22,71.75
  Bottom 0.813: R4.2 20.92,22.41 D1.C
  Bottom 1.27: v14.22,29.53 R24.2 11.75,34.54 v11.75,46.67
  Bottom 1.524: v14.22,29.53 14.29,29.53 D1.C
  pour Bottom (isolate 0.61): 82.55,73.34 47.94,73.34 47.94,58.42 45.72,56.2 43.18,56.2 42.54,56.83 42.54,58.1 43.18,58.74 45.08,58.74 46.04,59.69 46.04,75.56 47.31,76.84 82.23,76.84 82.55,76.52
C1
  Top 0.508: J5.16 43.86,84.14 43.23,84.77 X5.1
  Bottom 0.61: Q5.7 Q5.8
  Bottom 1.016: X5.1 41.4,84.22 Q5.8
C2
  Top 0.508: J5.14 43.81,81.6 42.7,82.71 38.95,82.71 X5.2
  Bottom 0.61: Q5.5 Q5.6
  Bottom 1.016: X5.2 37.34,84.32 Q5.5
C3
  Top 0.508: J5.12 43.66,79.06 41.27,81.44 36.26,81.44 X5.3
  Bottom 0.61: Q6.7 Q6.8
  Bottom 1.016: X5.3 33.15,84.55 Q6.8
C4
  Top 0.508: J5.10 43.5,76.52 39.85,80.17 33.57,80.17 X5.4
  Bottom 0.61: Q6.5 Q6.6
  Bottom 1.016: Q6.5 29.08,82.36 28.89,82.55 28.89,84.7 X5.4
C5
  Top 0.508: J5.8 44.29,74.14 43.5,74.14 38.73,78.9 30.88,78.9 X5.5
  Bottom 0.61: Q7.7 Q7.8
  Bottom 1.016: Q7.8 24.89,82.36 25.08,82.55 25.08,84.7 X5.5
C6
  Top 0.508: J5.6 43.66,71.44 37.46,77.63 28.19,77.63 X5.6
  Bottom 0.61: Q7.5 Q7.6
  Bottom 1.016: X5.6 20.83,84.55 Q7.5
C7
  Top 0.508: J5.4 44.29,69.06 43.5,69.06 36.35,76.2 25.66,76.2 X5.7
  Bottom 0.61: Q8.7 Q8.8
  Bottom 1.016: X5.7 16.64,84.32 Q8.8
C8
  Top 0.508: J5.2 44.29,66.52 43.66,66.52 35.24,74.93 22.97,74.93 X5.8
  Bottom 0.61: Q8.5 Q8.6
  Bottom 1.016: X5.8 12.57,84.22 Q8.5
DS  (via drill 1 pad 2)
  Top 0.61: v34.92,49.85 40,49.85 41.27,48.58 41.27,38.1 42.86,36.51 64.45,36.51 U3.P11
  Bottom 0.61: IC2.14 35.88,48.9 v34.92,49.85
GND  (1 unrouted)
  Top 0.61: Q9.3 33.02,14.29
  Top 0.813: 17.64,3.67 J3.1 11.35,3.67
  Bottom 0.61: 28.57,58 28.57,55.56 23.49,55.56 IC1.13
  Bottom 0.813: 11.35,3.67 J3.1 17.6,3.67
  pour Top (isolate 0.508, rank 3, no thermals): 92.07,87.31 0.63,87.31 0.63,0.95 92.07,0.95
  pour Bottom (isolate 0.508, rank 2): 92.07,87.31 0.63,87.31 0.63,0.95 92.07,0.95
GP10
  Top 0.61: IC6.5 4.53,33.11 9.44,38.01 26.76,38.01 33.02,31.75 61.59,31.75 U3.P8
I1
  Top 0.508: IC5.3 60.64,65.04 61.28,65.67 66.83,65.67 72.34,60.17 RN1.3 R39.1
I2
  Top 0.508: R43.1 RN1.4 72.07,62.71 67.94,66.83 60.8,66.83 59.37,65.41 IC5.4
I3
  Top 0.508: R44.1 RN1.5 71.91,65.25 69.2,67.95 60.34,67.95 58.25,65.87 58.25,63.92 IC5.5
I4
  Top 0.508: R47.1 RN1.6 71.91,67.79 70.62,69.07 59.88,69.07 56.98,66.18 56.98,63.92 IC5.6
I5
  Top 0.508: R48.1 RN1.7 59.55,70.33 55.71,66.49 55.71,63.92 IC5.7
I6
  Top 0.508: R49.1 RN1.8 72.23,72.87 70.96,71.6 59.24,71.6 54.44,66.8 54.44,63.92 IC5.8
IN-C1
  Bottom 0.61: 40.32,69.21 R8.2 40.32,67.63 36.83,64.14 30.8,64.14 27.3,60.64 IC1.7
IN-C2
  Bottom 0.61: IC1.6 26.03,61.59 30.01,65.57 35.88,65.57 37.46,67.16 R15.2
IN-C3
  Bottom 0.61: R17.2 32.07,67.79 31.43,67.16 29.37,67.16 24.76,62.55 IC1.5
IN-C4
  Bottom 0.61: R22.2 29.21,69.11 23.49,63.4 IC1.4
IN-C5
  Bottom 0.61: R27.2 23.81,65.89 22.22,64.3 IC1.3
IN-C6
  Bottom 0.61: R32.2 IC1.2
IN-C7
  Bottom 0.61: 15.56,69.21 R37.2 15.56,67.94 19.43,64.07 IC1.1
IN-C8
  Bottom 0.61: 12.7,69.21 R42.2 12.7,68.26 17.46,63.5 17.46,55.25 18.1,54.61 20.32,54.61 20.95,53.97 IC1.15
L1
  Top 0.508: X4.1 69.9,75.09 57.78,75.09 49.05,66.36 J5.1
  Bottom 0.61: Q1.8 Q1.7
  Bottom 1.016: X4.1 81.09,83.27 Q1.8
L2
  Top 0.508: X4.2 67.21,76.36 56.52,76.36 49.05,68.9 J5.3
  Bottom 0.61: Q1.6 Q1.5
  Bottom 1.016: X4.2 77.03,83.37 Q1.5
L3
  Top 0.508: X4.3 64.52,77.63 55.24,77.63 49.05,71.44 J5.5
  Bottom 0.61: Q2.7 Q2.8
  Bottom 1.016: X4.3 71.66,82.23 72.2,81.7 Q2.8
L4
  Top 0.508: J5.7 49.05,73.98 53.97,78.9 61.83,78.9 X4.4
  Bottom 0.61: Q2.6 Q2.5
  Bottom 1.016: X4.4 67.7,81.91 68.13,81.48 Q2.5
L5
  Top 0.508: X4.5 59.14,80.17 52.7,80.17 49.05,76.52 J5.9
  Bottom 0.61: Q3.7 Q3.8
  Bottom 1.016: Q3.8 63.31,81.41 63.82,81.91 63.82,84.7 X4.5
L6
  Top 0.508: J5.11 49.21,79.06 51.59,81.44 56.2,81.44 59.53,84.77 X4.6
  Bottom 0.61: Q3.5 Q3.6
  Bottom 1.016: Q3.5 59.24,81.15 59.78,81.69 X4.6
L7
  Top 0.508: J5.13 49.37,82.71 53.76,82.71 X4.7
  Bottom 0.61: Q4.7 Q4.8
  Bottom 1.016: X4.7 54.42,83.37 Q4.8
L8
  Top 0.508: X4.8 49.48,84.77 48.85,84.14 J5.15
  Bottom 0.61: Q4.5 Q4.6
  Bottom 1.016: X4.8 50.35,83.27 Q4.5
N$1
  Top 0.61: J1.1 64.45,6.67 U3.P0
  Bottom 0.508: U3.P0 70.17,12.38 73.98,12.38 74.61,13.02 U1.7
N$2
  Top 0.61: J1.2 61.91,6.67 U3.P1
  Bottom 0.508: U1.6 73.34,17.35 72.39,18.3 69.74,18.3 68.9,17.46 68.9,13.65 U3.P1
N$3
  Top 1.27: J3.3 18.16,9.67 X6.2
  Bottom 1.27: J3.3 18.16,9.67 X6.2
  Bottom 1.524: 14.35,9.6 J3.3 D1.A
N$4  (via drill 1 pad 2.03)
  Top 0.813: D2.A v23.81,7.94
  Bottom 0.813: R4.1 v23.81,7.94
N$5
  Top 0.61: J6.1 62.86,18.41 63.5,17.78 U3.P4
N$6
  Top 0.61: TR10.C 48.59,17.48 R16.2 R3.2
N$7
  Top 0.61: R3.1 45.75,14.9 46.44,14.2 Q10.B
N$8
  Top 0.61: J6.2 62.86,20.96 63.5,20.32 U3.P5
N$9
  Top 0.61: U3.P28 X2.6
N$10
  Top 0.61: U3.P27 X2.5
N$11
  Top 0.61: U3.P26 X2.4
N$12
  Bottom 0.61: IC2.15 37.57,50.16 36.93,50.8 36.93,52.7 37.57,53.34 47.68,53.34 48.31,52.7 IC3.8
N$13
  Top 0.61: U3.P15 X2.3
N$14
  Top 0.508: X3.1 85.87,72.07 85.07,72.87 R49.2
N$15
  Bottom 0.61: IC3.7 47.21,51.44 46.95,51.69 IC2.1
N$16
  Bottom 0.508: Q1.2 79.69,69.21 80.16,68.75 R6.2 R7.1
N$17
  Top 0.508: X3.2 86.82,68.11 84.61,70.33 R48.2
N$18
  Bottom 0.61: R14.2 77.79,56.52 66.36,45.09 IC3.17
N$19
  Bottom 0.61: Q5.2 40,72.39 40.17,72.22 R8.1 40.32,72.71
N$20
  Bottom 0.508: R14.1 R10.2 76.03,68.75 75.56,69.21 75.56,73.98 76,74.41 Q1.4
N$21
  Bottom 0.61: IC3.6 IC2.2
N$22
  Bottom 0.508: Q2.2 70.8,69.21 71.27,68.75 R13.2 R11.1
N$23  (via drill 1 pad 2.03)
  Top 0.61: Q10.E 44.37,11.2 43.83,11.75 v43.81,11.75
  Bottom 0.61: v43.81,11.75 46.99,8.57 X1.6
N$24
  Top 0.508: R47.2 84.14,67.79 X3.3
N$25
  Top 0.508: R44.2 82.72,65.25 X3.4
N$26
  Bottom 0.61: IC3.5 IC2.3
N$27
  Bottom 0.813: Q5.4 37.46,74.28 R15.1
N$28
  Top 0.508: X3.5 81.3,62.71 R43.2
N$29
  Bottom 0.61: IC3.4 IC2.4
N$30
  Top 0.508: R39.2 81.11,60.17 84.77,56.52 84.77,55.28 X3.6
N$31
  Bottom 0.61: R7.2 81.6,58.1 67.06,43.56 IC3.18
N$32
  Bottom 0.508: R21.1 68.9,68.58 | 68.9,68.58 R20.2 | 68.9,68.58 67.31,68.58 66.67,69.21 66.67,73.98 67.11,74.41 Q2.4
N$33
  Top 0.61: Q9.4 31.62,17.02 32.38,17.78 34.29,17.78 | 34.29,17.78 Q9.2 | 34.29,17.78 34.29,27.2 R18.2
N$34
  Bottom 0.61: C1.1 U1.8
N$35
  Bottom 0.61: Q6.2 31.75,72.22 R17.1 32.07,72.71
N$36
  Bottom 0.61: U1.2 74.61,6.98 U$3.D-
N$37
  Bottom 0.61: IC3.3 IC2.5
N$38
  Bottom 0.61: IC3.2 IC2.6
N$39
  Bottom 0.61: IC3.1 49.96,43.81 IC2.7
N$40
  Bottom 0.61: IC3.16 65.41,46.36 72.71,53.66 R11.2
N$41
  Bottom 0.61: IC3.15 64.45,47.63 68.9,52.07 R21.2
N$42
  Bottom 0.508: Q3.2 61.91,68.9 62.23,68.58 63.82,68.58 | 63.82,68.58 R26.1 | R25.2 63.82,68.58
N$44
  Bottom 0.813: Q6.4 29.21,74.28 R22.1
N$45
  Bottom 0.61: U$3.D+ 76.01,5.84 U1.1
N$46
  Top 0.61: U3.P14 X2.2
N$47
  Top 0.61: X2.1 80.64,30.48 U3.P13
N$48
  Bottom 0.61: IC3.14 63.77,48.9 66.67,51.8 66.67,56.98 63.82,59.84 R26.2
N$49
  Bottom 0.508: Q3.4 59.13,74.3 58.1,74.3 57.78,73.98 57.78,69.21 58.42,68.58 60.01,68.58 | 60.01,68.58 R31.1 | R30.2 60.01,68.58
N$51
  Bottom 0.61: 23.81,72.71 R27.1 23.49,72.22 Q7.2
N$55
  Bottom 0.61: IC3.13 63.18,50.16 64.94,51.92 64.94,56.52 60.01,61.44 R31.2
N$56
  Bottom 0.508: Q4.2 53.02,69.38 53.66,68.75 R35.2 R36.1
N$58
  Bottom 0.813: Q7.4 20.95,74.28 R32.1
N$60
  Top 1.016: Q9.8 Q9.7 Q9.6 Q9.5 31.75,10.27 X1.2
N$62
  Bottom 0.61: IC3.12 62.55,51.44 63.18,52.07 63.18,56.2 62.55,56.83 59.69,56.83 54.93,61.59 R36.2
N$63
  Bottom 0.508: Q4.4 50.24,74.3 49.21,74.3 48.89,73.98 48.89,69.21 49.36,68.75 R38.2 R41.1
N$65
  Bottom 0.61: R37.1 15.4,72.22 15.24,72.39 Q8.2
N$68
  Top 0.813: IC6.2 9.64,33.1 11.23,34.68 15.87,34.68 17.64,32.92 17.64,23.85
  Top 1.016: D5.C 17.64,23.85 L1.2
N$69
  Bottom 0.61: IC3.11 58.69,52.7 51.12,60.27 R41.2
N$70
  Bottom 0.813: Q8.4 12.7,74.28 R42.1
N$71
  Top 0.61: IC6.4 6.24,32.59 9.95,36.3 19.41,36.3 R5.1
  Top 0.813: R2.2 R5.1
N$73
  Top 0.61: R28.1 58.27,12.7 54.44,16.53 TR10.B
N$74
  Top 0.508: TR12.B 49.53,23.98 R45.1
N$84
  Bottom 0.61: IC1.14 22.22,50.27 23.49,49 23.49,44.77 28.26,40 38.14,40 39.15,41.02 IC2.9
N$86  (via drill 1 pad 2.03)
  Top 0.61: R45.2 46.37,23.83 46.36,23.81 v44.28,23.81
  Bottom 0.61: v44.28,23.81 50.8,17.3 X1.7
O1
  Top 0.508: D6.B 64.13,46.82 RN2.3 64.13,49.9 62.86,51.17 61.91,51.17 60.64,52.44 IC5.16
O2
  Top 0.508: D6.E RN2.4 61.59,49.85 59.37,52.07 IC5.15
O3
  Top 0.508: IC5.14 58.1,51.49 59.05,50.53 RN2.5 59.05,46.82 D3.B
O4
  Top 0.508: IC5.13 56.83,51.12 56.52,50.8 RN2.6 D3.E
O5
  Top 0.508: IC5.12 55.56,52.02 53.97,50.43 RN2.7 53.97,46.82 D4.B
O6
  Top 0.508: IC5.11 54.29,52.76 51.43,49.9 RN2.8 D4.E
OFFSET_INT  (via drill 1 pad 2.03)
  Top 0.508: D4.C D3.C D6.C v75.56,43.99
  Top 0.61: v75.56,35.88 U3.P12
  Bottom 0.61: v75.56,43.99 v75.56,35.88
P2
  Top 0.61: R28.2 U3.P2
P3
  Top 0.508: TR12.E 54.29,23.66 55.08,22.88 R46.2
  Top 0.61: R46.2 56.52,20.15 56.52,16.83 58.1,15.24 U3.P3
P6
  Top 0.61: X1.4 39.37,8.89 37.78,10.48 37.78,21.27 37.09,21.96 37.09,23.23 36.99,23.24 R9.2 36.99,26.31 38.78,28.09 60.1,28.09 65.33,22.86 U3.P6
P7
  Top 0.61: R18.1 36.51,29.53 61.28,29.53 U3.P7
SH_CP  (via drill 1 pad 2)
  Top 0.61: v31.43,45.09 41.27,35.24 63.18,35.24 U3.P10
  Bottom 0.61: IC1.11 26.03,47.63 28.57,45.09 v31.43,45.09 IC2.11
ST_CP  (via drill 1 pad 2)
  Top 0.61: v28.57,42.86 30.8,42.86 39.69,33.97 61.91,33.97 U3.P9
  Bottom 0.61: v28.57,42.86 24.76,46.67 IC1.12 24.76,53.4 25.69,54.32 29.82,54.32 31.11,53.02 31.11,48.58 33.34,46.36 IC2.12
VCC  (via drill 1 pad 2.03)
  Top 0.61: R16.1 45.39,19.7 | R16.1 45.73,19.68 v42.86,19.68 42.86,15.87 46.04,12.7 Q10.C | 46.16,19.28 R16.1
  Top 1.27: IC4.1 8.92,61.56 C3.+ 13.97,61.53 14.22,61.28 R24.1
  Bottom 0.813: R24.1 14.22,39.43 33.97,19.68 v42.86,19.68
  pour Top (isolate 0.305, no thermals): 44.13,15.24 56.2,15.24 56.2,9.21 47.62,9.21 42.54,14.29 42.54,20.32 46.35,20.32 46.35,18.73 44.77,18.73 44.13,18.1

### Text on the board
tValues: C8 C7 C6 C5 C4 C3 C2 C1 | L8 L7 L6 L5 L4 L3 L2 L1 | H1...H6 | OFFSET / POSITION | 74hc595 | MCU-VM 4.6 / timtektgm2025 | OFFSET / interrupt | ST_CP | SH_CP | DS | lock_12v | lock_trigger | P13 | suhu | P14 | UART1 | P15 | G | P26 | RX | P27 | TX | P28 | IR_int | IR_trig | (+)LOCK(-) | (-) DS18 (+) | (+) IR_int (-) | UART0 | 24V | G | RX | TX